# EAGLE design ADC-Board-schematics (EAGLE 6.2)
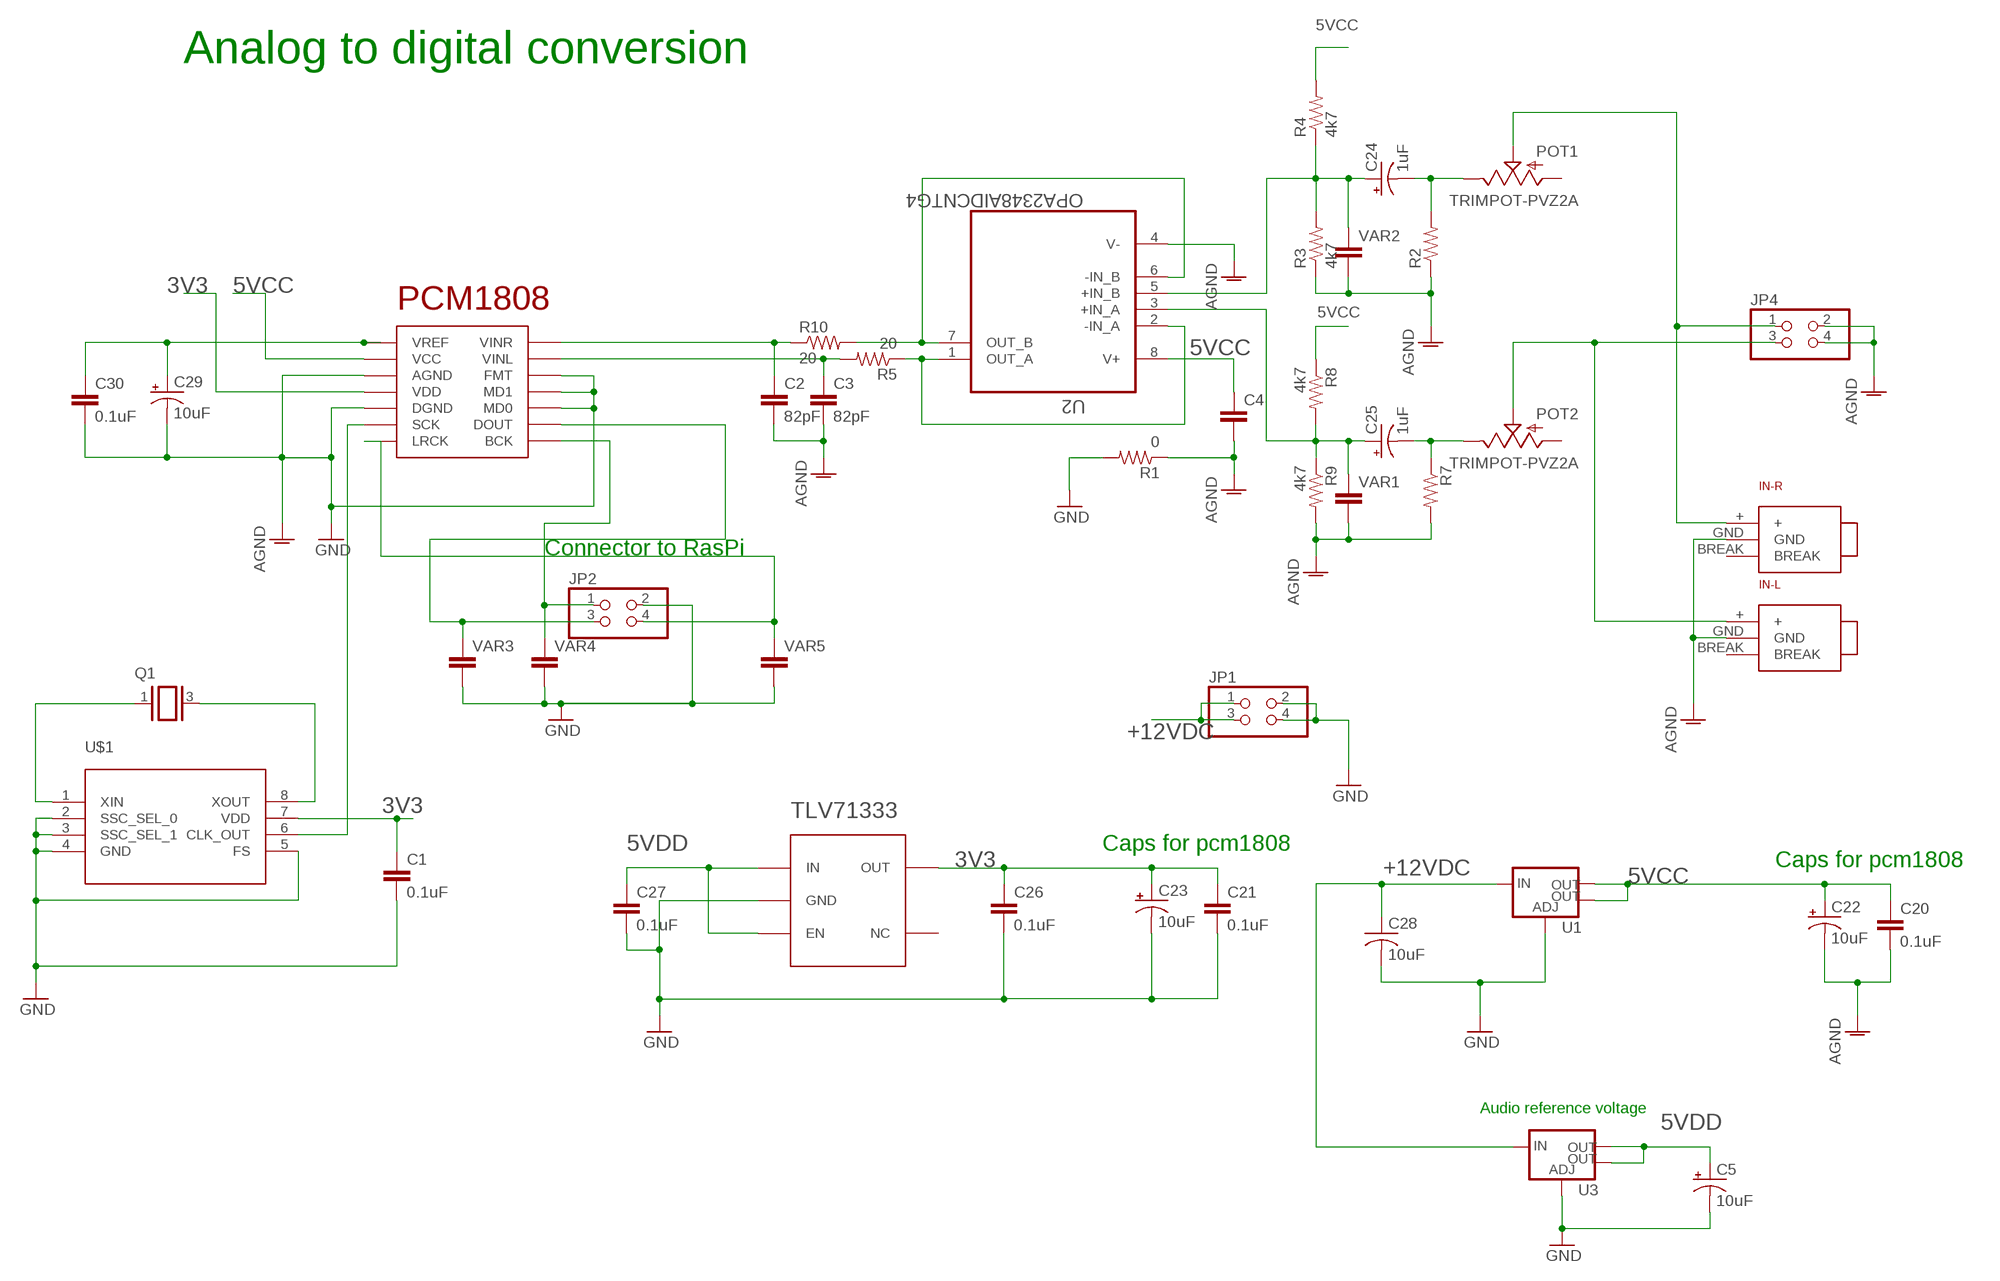
[diagram p0: schematic, sheet 1]

## Parts
C1  0.1uF  C-EUC0603  [C0603]
C2  82pF  CAP0603-CAP  [0603-CAP]
C3  82pF  CAP0603-CAP  [0603-CAP]
C4  CAP0603-CAP  [0603-CAP]
C5  10uF  CPOLRAD  [RADIALCAN4MM]
C20  0.1uF  C-EUC0603  [C0603]
C21  0.1uF  C-EUC0603  [C0603]
C22  10uF  CPOLRAD  [RADIALCAN4MM]
C23  10uF  CPOLRAD  [RADIALCAN4MM]
C24  1uF  CPOLRAD  [RADIALCAN4MM]
C25  1uF  CPOLRAD  [RADIALCAN4MM]
C26  0.1uF  C-EUC0603  [C0603]
C27  0.1uF  C-EUC0603  [C0603]
C28  10uF  C-USC1206  [C1206]
C29  10uF  CPOLRAD  [RADIALCAN4MM]
C30  0.1uF  C-EUC0603  [C0603]
IN-L  3MM5-PLUG  [3MM5-PLUG]
IN-R  3MM5-PLUG  [3MM5-PLUG]
JP1  PINHD-2X2  [2X02]
JP2  PINHD-2X2  [2X02]
JP4  PINHD-2X2  [2X02]
PCM1808  PCM1808PW  [R-PDSO-G14]
POT1  TRIMPOT-PVZ2A  [PVZ2A]
POT2  TRIMPOT-PVZ2A  [PVZ2A]
Q1  XTAL  [5X3CRYSTAL]
R1  0  RESISTOR0603-RES  [0603-RES]
R2  RESISTOR0603-RES  [0603-RES]
R3  4k7  RESISTOR0603-RES  [0603-RES]
R4  4k7  RESISTOR0603-RES  [0603-RES]
R5  20  RESISTOR0603-RES  [0603-RES]
R7  RESISTOR0603-RES  [0603-RES]
R8  4k7  RESISTOR0603-RES  [0603-RES]
R9  4k7  RESISTOR0603-RES  [0603-RES]
R10  20  RESISTOR0603-RES  [0603-RES]
TLV71333  TVL713  [SOT23-5]
U1  V_REG_LM1117SOT223  [SOT223]
U2  OPA2348AIDCNTG4  [SOT65P280X145-8N]
U3  V_REG_LM1117SOT223  [SOT223]
U$1  CDCS502TSSOP-8  [TSSOP-8]
VAR1  CAP0603-CAP  [0603-CAP]
VAR2  CAP0603-CAP  [0603-CAP]
VAR3  CAP0603-CAP  [0603-CAP]
VAR4  CAP0603-CAP  [0603-CAP]
VAR5  CAP0603-CAP  [0603-CAP]

## Nets
3V3: C1.1 C21.1 C23.1(+) C26.1 PCM1808.4(VDD) TLV71333.5(OUT) U$1.7(VDD)
5VCC: C4.1 C20.1 C22.1(+) PCM1808.3(VCC) R4.2 R8.1 U1.2(OUT) U1.4(OUT) U2.8(V+)
5VDD: C5.1(+) C27.1 TLV71333.1(IN) TLV71333.3(EN) U3.2(OUT) U3.4(OUT)
+12VDC: C28.1 JP1.1 JP1.3 U1.3(IN) U3.3(IN)
AGND: C2.2 C3.2 C4.2 IN-L.GND IN-R.GND JP4.2 JP4.4 R1.1 R2.1 R3.1 R7.2 R9.2 U2.4(V-) VAR1.2 VAR2.2
GND: C1.2 C5.2(-) C20.2 C21.2 C22.2(-) C23.2(-) C26.2 C27.2 C28.2 C29.2(-) C30.2 JP1.2 JP1.4 JP2.2 PCM1808.2(AGND) PCM1808.5(DGND) PCM1808.10(MD0) PCM1808.11(MD1) PCM1808.12(FMT) R1.2 TLV71333.2(GND) U1.1(ADJ) U3.1(ADJ) U$1.2(SSC_SEL_0) U$1.3(SSC_SEL_1) U$1.4(GND) U$1.5(FS) VAR3.2 VAR4.2 VAR5.2 ; supply symbol labelled AGND
N$1: JP2.1 PCM1808.8(BCK) VAR4.1
N$3: C24.2(-) POT1.3(E) R2.2
N$4: JP2.3 PCM1808.9(DOUT) VAR3.1
N$5: C24.1(+) R3.2 R4.1 U2.5(+IN_B) VAR2.1
N$6: R5.1 U2.1(OUT_A) U2.2(-IN_A)
N$7: C3.1 PCM1808.13(VINL) R5.2
N$8: C25.2(-) POT2.3(E) R7.1
N$9: C25.1(+) R8.2 R9.1 U2.3(+IN_A) VAR1.1
N$10: R10.2 U2.6(-IN_B) U2.7(OUT_B)
N$11: C2.1 PCM1808.14(VINR) R10.1
N$12: JP2.4 PCM1808.7(LRCK) VAR5.1
N$20: IN-L.+ JP4.3 POT2.2(S)
N$21: IN-R.+ JP4.1 POT1.2(S)
N$29: Q1.1 U$1.1(XIN)
N$30: Q1.3 U$1.8(XOUT)
N$31: C29.1(+) C30.1 PCM1808.1(VREF)
N$32: PCM1808.6(SCK) U$1.6(CLK_OUT)
Unconnected: IN-L.BREAK IN-R.BREAK POT1.1(A) POT2.1(A) TLV71333.4(NC)

## Notes on the sheet
- Analog to digital conversion
- Connector to RasPi
- Caps for pcm1808
- Caps for pcm1808
- Audio reference voltage

## Library data of the parts
C1 C20 C21 C26 C27 C30 = rcl:C-EU: CAPACITOR, European symbol
C2-C4 VAR1-VAR5 = SparkFun-Passives:CAP: Capacitor Standard 0603 ceramic capacitor, and 0.1" leaded capacitor.
C5 C22-C25 C29 = rcl:CPOLRAD
C28 = rcl:C-US: CAPACITOR, American symbol
IN-L IN-R = Pekkas_libraries:3MM5-PLUG
JP1 JP2 JP4 = pinhead:PINHD-2X2: PIN HEADER
PCM1808 = Pekkas_libraries:PCM1808PW: TEXAS INSTRUMENTS PCM1808PW. Analogue to Digital Converter, 24 bit, 96 kSPS, Single, 4.5 V, 5.5 V, TSSOP
POT1 POT2 = SparkFun-Resistors:TRIMPOT-PVZ2A
Q1 = Pekkas_libraries:XTAL: TXC 7B-12.288MEEQ-T XTAL, 12.288MHZ, 10PF, SMD, 5.0X3.2
R1-R5 R7-R10 = SparkFun-Passives:RESISTOR: Resistor Basic schematic elements and footprints for 0603, 1206, and PTH resistors.
TLV71333 = Pekkas_libraries:TVL713: TEXAS INSTRUMENTS TLV71333PDBVR Fixed LDO Voltage Regulator, 1.4V to 5.5V, 230mV Dropout, 3.3Vout, 150mAout, SOT-23-5
U1 U3 = SparkFun-PowerIC:V_REG_LM1117: Voltage Regulator LM1117 Standard adjustable voltage regulator but in SMD form. Spark Fun Electronics SKU : COM-00595; PROD_ID: VREG-08170
U2 = Pekkas_libraries:OPA2348AIDCNTG4: OPERATIONAL AMPLIFIERS; MPN: OPA2348AIDCNTG4; OC_FARNELL: 1207098; OC_NEWARK: 97K6805; PACKAGE: SOT23-8; SUPPLIER: Texas Instruments
U$1 = components:CDCS502

## Board
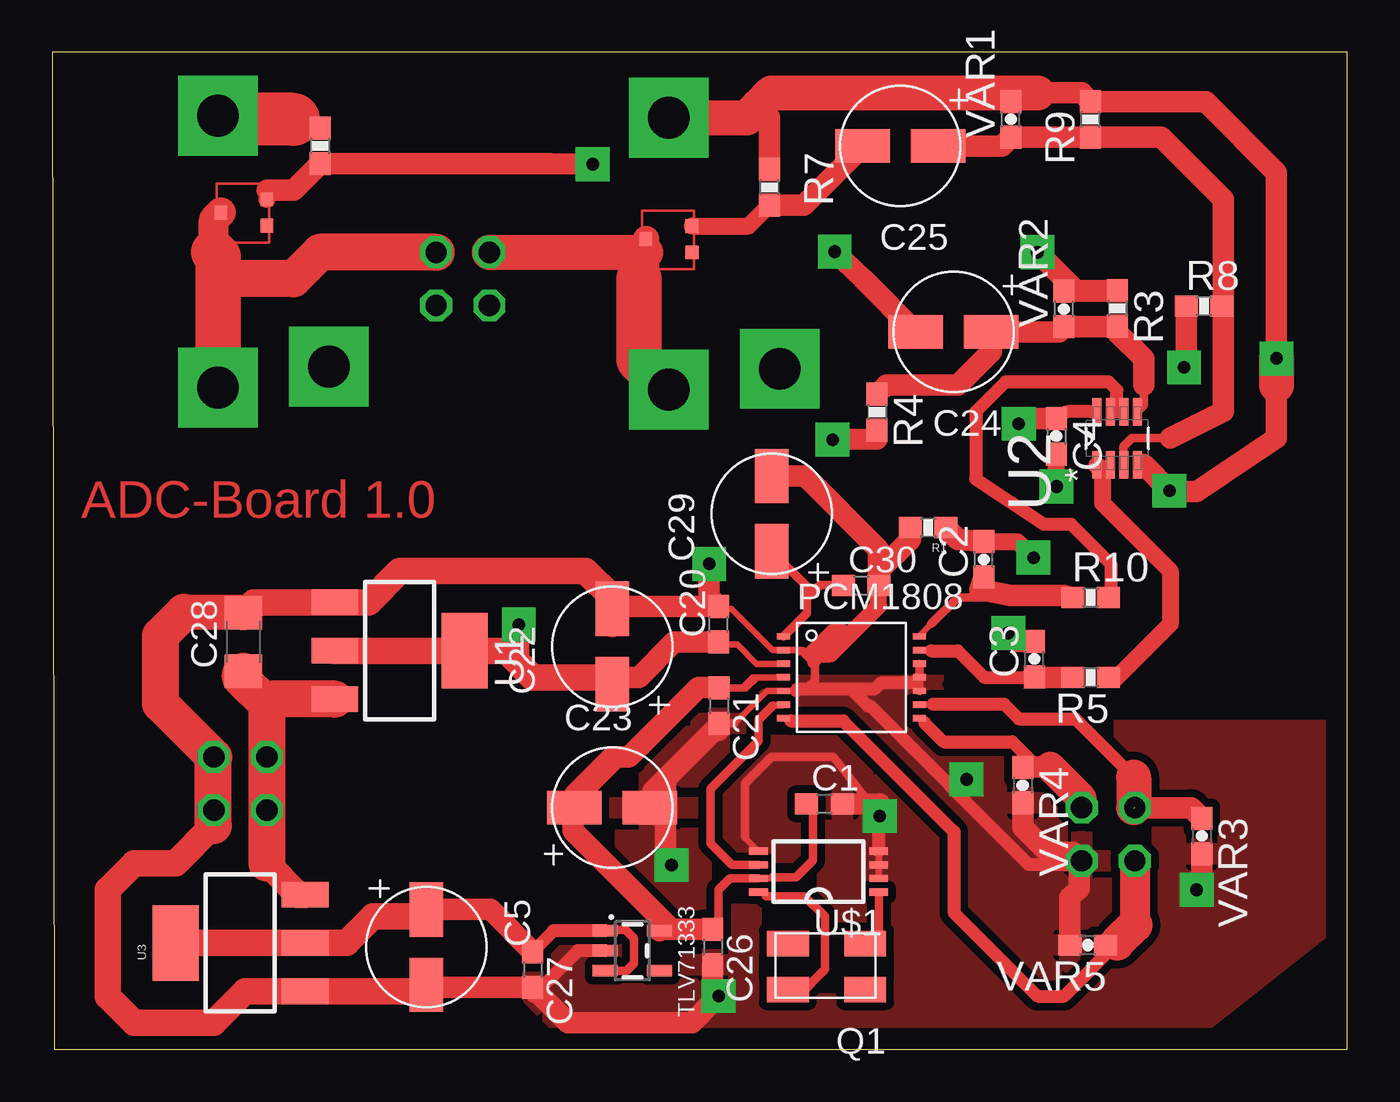
[diagram p1: board, top side]
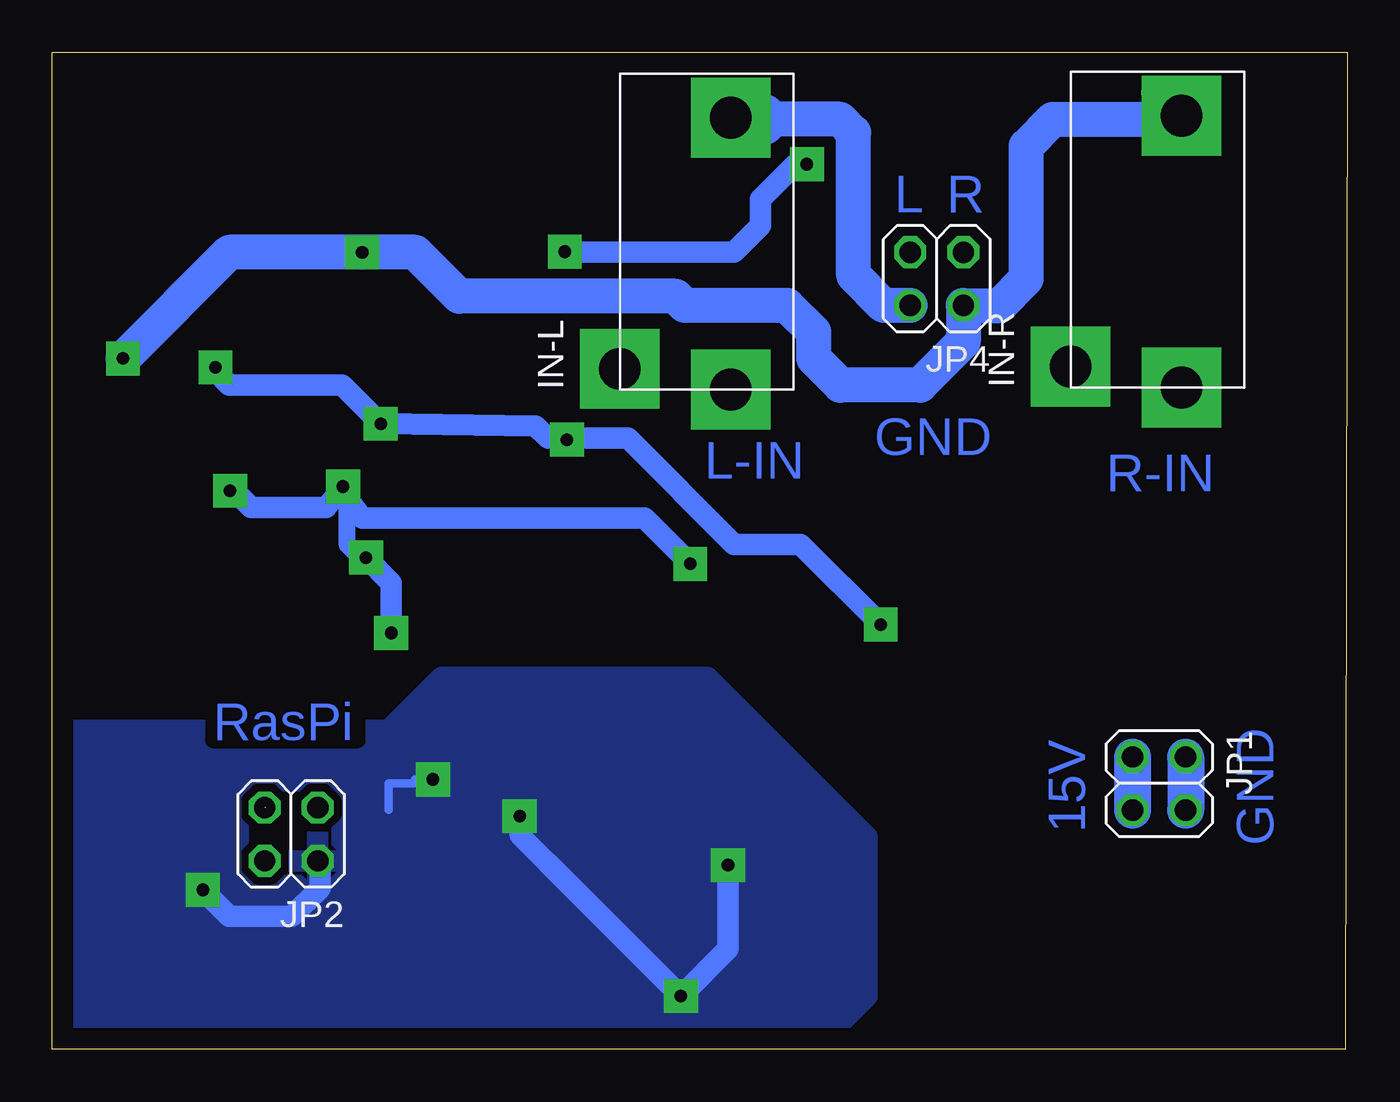
[diagram p2: board, bottom side, seen from below]

Size 61.9 x 47.66 mm. Coordinates in mm from the lower left corner, seen from the top.
Outline: 0.1,0 61.9,0 61.9,47.66 0,47.66 0.1,0
Copper layers (1*16): Top 0.035mm / dielectric 1.5mm / Bottom 0.035mm
Design rules: minimum track width 10mil, minimum drill 24mil, track to track 15mil, track to pad 15mil, pad to pad 15mil, via to via 15mil, smd to smd 8mil, copper to edge 40mil, drill to drill 8mil, minimum pad ring 10mil, minimum via ring 20mil, stop-mask expansion 4mil, vias tented up to drill 0mil, thermal gap 10mil

### Footprints (pad centres in the part's own frame; a part is rotated, then mirrored left to right if it is on the bottom)
C0603 = smd 1.1 x 1: 1 -0.85,0; 2 0.85,0
0603-CAP = smd 1.1 x 1: 1 -0.85,0; 2 0.85,0
RADIALCAN4MM = smd 2.6 x 1.6: 1 -1.6,0; 2 2,0
C1206 = smd 1.6 x 1.8: 1 -1.4,0; 2 1.4,0
3MM5-PLUG = drill 2 pad 3.81 square: + -13,0; BREAK -12,5.3; GND 0,0
2X02 = drill 1.016 octagon: 1 -1.27,-1.27; 2 -1.27,1.27; 3 1.27,-1.27; 4 1.27,1.27
R-PDSO-G14 = smd 0.61 x 0.305: 1 -3.25,1.95; 2 -3.25,1.3; 3 -3.25,0.65; 4 -3.25,0; 5 -3.25,-0.65; 6 -3.25,-1.3; 7 -3.25,-1.95; 8 3.25,-1.95; 9 3.25,-1.3; 10 3.25,-0.65; 11 3.25,0; 12 3.25,0.65; 13 3.25,1.3; 14 3.25,1.95
PVZ2A = smd 0.65 x 0.6: 1 0,0; 2 0.625,2.2; 3 1.25,0
5X3CRYSTAL = smd 2 x 1.2: 1 0,0; 2 3.7,0; 3 3.7,2.2; 4 0,2.2
0603-RES = smd 1.1 x 1: 1 -0.85,0; 2 0.85,0
SOT23-5 = smd 0.55 x 1.2: 1 -0.95,-1.3; 2 0,-1.3; 3 0.95,-1.3; 4 0.95,1.3; 5 -0.95,1.3
SOT223 = smd 1.219 x 2.235: 1 -2.311,-3.099; 2 0,-3.099; 3 2.311,-3.099 | smd 3.6 x 2.2: 4 0,3.099
SOT65P280X145-8N = smd 1.321 x 0.432: 1 -1.27,0.965; 2 -1.27,0.33; 3 -1.27,-0.33; 4 -1.27,-0.965; 5 1.27,-0.965; 6 1.27,-0.33; 7 1.27,0.33; 8 1.27,0.965
TSSOP-8 = smd 0.9 x 0.35: 1 -2.875,0.975; 2 -2.875,0.325; 3 -2.875,-0.325; 4 -2.875,-0.975; 5 2.875,-0.975; 6 2.875,-0.325; 7 2.875,0.325; 8 2.875,0.975

### Placement (x,y rotation side)
C1  36.91,11.73 0 top
C2  44.53,23.42 90 top
C3  46.95,18.65 90 top
C4  47.99,29.31 270 top
C5  17.88,5.08 270 top
C20  31.85,20.32 90 top
C21  31.86,16.43 270 top
C22  26.77,19.05 90 top
C23  26.56,11.54 0 top
C24  43.28,34.29 180 top
C25  40.74,43.18 180 top
C26  31.57,4.89 270 top
C27  22.96,3.81 270 top
C28  9.14,19.47 90 top
C29  34.39,25.4 90 top
C30  38.67,22.16 0 top
IN-L  29.47,44.53 90 bottom
IN-R  7.92,44.63 90 bottom
JP1  8.99,12.7 270 bottom
JP2  50.48,10.28 180 bottom
JP4  19.62,36.83 180 bottom
PCM1808  38.2,17.78 0 top
POT1  10.26,39.37 90 top
POT2  30.58,38.1 90 top
Q1  38.86,5.05 180 top
R1  41.86,24.94 180 top
R2  12.8,43.18 270 top
R3  50.92,35.42 270 top
R4  39.43,30.46 270 top
R5  49.63,17.78 180 top
R7  34.29,41.21 90 top
R8  55.06,35.53 0 top
R9  49.63,44.45 90 top
R10  49.63,21.59 0 top
TLV71333  27.73,4.71 270 top
U1  16.61,19.05 270 top
U2  50.9,29.21 90 top
U3  8.99,5.08 90 top
U$1  36.63,8.49 180 top
VAR1  45.82,44.45 90 top
VAR2  48.36,35.39 90 top
VAR3  54.95,10.19 270 top
VAR4  46.39,12.62 270 top
VAR5  49.5,4.98 180 top

### Tracks (layer width: path | path; a pad name or v marks a point on that pad's centre or on a via)
3V3
  Top 0.305: C21.1 31.9,17.24 33.16,17.24 33.7,17.78 PCM1808.4 33.48,17.78 33,17.3 31.1,17.3 30.8,17 30.5,17 24.9,11.4 | U$1.7 34.36,8.16 34.41,8.22
  Top 0.406: C1.1 36.36,11.43 36.36,9.04 35.54,8.22 34.41,8.22 | U$1.7 32.4,8.16 31.85,7.62 31.85,6.02 C26.1
  Top 1.016: C23.1 24.96,12.16 26.77,13.97 27.57,13.97 30.9,17.3 31.84,17.3 C21.1 | C26.1 29.6,5.74 | 29.6,5.74 29.11,5.74 TLV71333.5 | 24.9,11.4 24.9,10.44 29.6,5.74
5VCC  (via drill 0.6)
  Top 0.305: PCM1808.3 33.67,18.43 32.76,19.34 31.98,19.34 C20.1
  Top 0.406: U2.8 49.63,30.48
  Top 0.61: 49.63,30.48 48.51,30.48 C4.1
  Top 1.016: C20.1 29.73,19.47 28.04,17.78 27.1,17.78 C22.1 | C4.1 46.26,30.16 v46.2,29.9 | v22.3,20.3 22.3,18.9 22.07,18.67 | R4.2 39.43,29.17 v37.3,29.14 | R8.1 54.21,32.71 v54.1,32.6
  Top 1.27: U1.2 U1.4 21.69,19.05 22.07,18.67 22.96,17.78 26.44,17.78 C22.1
  Bottom 1.016: 36.93,29.21 38.2,29.21 38.79,29.8 v46.2,29.9 48.05,31.75 53.44,31.75 54.1,32.41 v54.1,32.6 | 36.93,29.21 34.39,29.21 29.31,24.13 26.13,24.13 v22.3,20.3 | v37.3,29.14 36.93,29.21
5VDD
  Top 0.406: TLV71333.3 27.46,3.76 27.8,4.1 27.8,5.3 27.4,5.7 26.47,5.7 TLV71333.1
  Top 0.61: TLV71333.1 23.96,5.66 C27.1
  Top 1.016: C5.1 20.94,6.68 C27.1
  Top 1.27: U3.4 U3.2 14.07,5.08 15.34,6.35 17.55,6.35 C5.1
+12VDC
  Top 1.27: U3.3 11.76,7.39 10.26,8.89
  Top 1.778: 10.26,16.51 JP1.1 10.26,8.89 | 10.26,16.51 8.99,17.78 8.99,17.92 C28.1 | U1.3 10.49,16.74 10.26,16.51
  Bottom 1.778: JP1.1 JP1.3
AGND  (via drill 0.6)
  Top 0.406: 52.17,27.94 U2.4 52.16,27.94 v53.4,26.7
  Top 0.813: C2.2 46.13,24.27 v46.9,23.5 | v48,26.9 C4.2
  Top 1.016: R2.1 11.95,44.03 11.53,44.45 | R7.2 34.29,44.55 33.76,45.09 | VAR1.2 46.24,45.72 47.09,45.72 49.21,45.72 R9.2 55.13,45.3 58.52,41.91 v58.52,33.02 | 58.52,31.75 58.52,29.21 54.71,26.67 53.44,26.67 52.17,27.94 | VAR2.2 50.89,36.24 R3.1 48.92,36.27 v47.09,38.1 | C2.2 43.28,24.37 R1.1 | C3.2 46.1,19.5 v45.7,19.9
  Top 1.676: IN-L.GND 33.2,44.53 33.76,45.09 34.39,45.72 47.09,45.72 | v58.52,33.02 58.52,31.75
  Top 2.54: 11.53,44.45 8.1,44.45 IN-R.GND
  Bottom 0.813: v46.9,23.5 47.3,23.6 47.8,24.1 47.8,26.5 v48,26.9
  Bottom 1.016: v53.4,26.7 53.2,26.7 52.4,25.9 48.8,25.9 v48,26.9 | v45.7,19.9 45.7,22.3 v46.9,23.5
  Bottom 1.676: 9.01,45.72 IN-R.GND 8.1,44.45 14.07,44.45 15.34,43.18 15.34,36.83 16.61,35.56 JP4.2 18.35,33.82 20.42,31.75 24.23,31.75 25.5,33.02 25.5,34.29 26.77,35.56 31.66,35.56 32.1,36 42.45,36 44.55,38.1 v47.09,38.1 53.44,38.1 v58.52,33.02 | JP4.4 22.16,35.56 23.6,37 23.6,43.82 24.23,44.45 28.04,44.45
  Bottom 2.54: 28.04,44.45 29.39,44.45 IN-L.GND
GND  (via drill 0.6)
  Top 0.305: 35.66,19.05 35.63,19.08 PCM1808.2 34.42,19.08 32.46,21.04 31.98,21.04 C20.2 | 35.56,17.14 PCM1808.5 34.16,17.14 32.6,15.58 C21.2 | 33.12,10.16 33.12,10.1 U$1.5 | U$1.2 U$1.3 U$1.4
  Top 0.406: 35.66,19.05 35.85,19.05 36.39,18.51 36.46,18.44 36.46,17.64 36.13,17.31 | 36.13,17.31 35.96,17.14 35.56,17.14 | 33.12,10.16 33.12,12.7 34.39,13.97 37.33,13.97 v39.56,11.14 | 38.36,17.24 36.2,17.24 36.13,17.31 | PCM1808.12 PCM1808.11 PCM1808.10 41.45,17.25 41.2,17.5 | C26.2 31.57,2.82 v31.85,2.54 | 32.6,15.58 32.19,15.58 31.85,15.24 29.31,12.7
  Top 0.61: 37.78,19.9 36.39,18.51 | U$1.4 39.51,11.69 v39.56,11.14 | TLV71333.2 25.13,4.71 22.96,2.54 C27.2 | 41.2,17.5 39.6,17.5 39.3,17.2 38.2,17.2 | 38.2,17.2 35.62,17.2 35.56,17.14 | 38.2,17.2 39,16.4 39.1,16.4 46.67,8.83 49.03,8.83 JP2.2
  Top 0.813: 37.78,19.9 37.3,19.9 36.3,18.9 37.2,18.9 39.5,21.2 39.5,22.14 C30.2
  Top 1: C1.2 39.55,11.73 v39.56,11.14
  Top 1.016: C5.2 18,2.96 C27.2 24.65,1.27 30.58,1.27 31.57,2.26 C26.2 | 31.85,15.24 31.64,15.24 28.7,12.3 28.7,11.68 C23.2 | 29.31,12.7 29.31,8.59 v29.6,8.8 | C22.2 26.89,21.17 C20.2 31.4,21.62 v31.4,23.2 | C29.2 36,27.4 39.5,23.9 39.5,22.86 | 39.5,22.86 39.5,22.18 C30.2 | R1.2 41.01,24.37 39.5,22.86 | VAR5.2 48.65,7.25 49.1,7.7 49.1,8.9 JP2.2 48.82,9.4 47.6,9.4 46.39,10.61 VAR4.2 | VAR3.2 54.95,7.86 v54.71,7.62
  Top 1.27: 7.7,10.7 5.89,8.89 3.91,8.89 2.64,7.62 2.64,2.54 3.91,1.27 7.72,1.27 9.22,2.77 U3.1 17.57,2.77 C5.2 | C28.2 9.63,21.36 U1.1 15.11,21.36 16.61,22.86 25.5,22.86 26.77,21.59 26.77,20.32
  Top 1.676: 6.3,20.9 9.11,20.9 C28.2
  Top 1.778: 6.3,20.9 5.18,19.78 5.18,16.51 JP1.2 7.7,13.95 7.7,10.7
  Bottom 0.406: v43.7,12.9 44.55,12.9 44.55,12.7 45.82,12.7 45.82,11.43
  Bottom 1: v39.56,11.14 39.56,10.25 38.2,8.89
  Bottom 1.016: 38.2,8.89 v31.85,2.54 29.6,4.79 v29.6,8.8 | 48.1,26.7 47.09,25.4 33.6,25.4 v31.4,23.2 | v54.71,7.62 53.44,6.35 50.45,6.35 49.1,7.7 49.1,8.9 JP2.2
  Bottom 1.778: JP1.2 JP1.4
  pour Top: 62.33,15.24 45.06,15.24 42.9,17.4 30.2,17.4 22.96,10.16 22.96,2.54 25,0.5 53.98,0.5 61.9,6.77 61.8,15.2 62.29,15.2
  pour Bottom: 62.33,15.24 45.82,15.24 43.28,17.78 30.58,17.78 22.96,10.16 22.96,2.54 25.5,0 62.33,0
N$1
  Top 0.305: PCM1808.8 41.47,15.83 41.7,15.6
  Top 0.61: 41.7,15.6 42.6,14.7 45.89,14.7 47.09,13.5
  Top 1.016: 47.7,13.5 47.09,13.5 46.42,13.5 VAR4.1
  Top 1.422: JP2.1 49.21,11.99 47.7,13.5
N$3  (via drill 0.6)
  Top 0.813: POT1.3 10.26,41.06
  Top 1.016: 10.26,41.06 11.53,41.06 R2.2 23.81,42.33 v25.83,42.31 | v37.4,38.13 38.74,36.83 C24.2
  Bottom 1.016: v37.4,38.13 36.93,38.1 29.31,38.1 28.04,39.37 28.04,40.64 26.37,42.31 v25.83,42.31
N$4  (1 unrouted)
  Top 0.305: PCM1808.9 42.08,16.48 42.1,16.5
  Top 0.61: 42.1,16.5 45.5,16.5 46.2,15.8 48.9,15.8 51.7,13
  Top 1.016: 51.7,11.54 54.45,11.54 VAR3.1
  Top 1.676: 51.7,13 51.7,11.54
N$5
  Top 0.406: 52.17,31.75 52.17,30.79 U2.5
  Top 1.016: 52.17,31.75 52.17,33.02 50.92,34.27 R3.2 50.89,34.54 VAR2.1 48.11,34.29 C24.1 44.88,33.35 43.28,31.75 39.87,31.75 R4.1
N$6
  Top 0.406: U2.1 U2.2
  Top 0.813: U2.1 49.94,27.86 50.2,27.6 50.2,26.1 53.44,22.86 53.44,20.32 50.87,17.75 R5.1
N$7
  Top 0.305: PCM1808.13 41.98,19.08 42.01,19.05
  Top 0.61: 42.01,19.05 43.28,19.05 44.55,17.78 47.09,17.78
  Top 1.016: R5.2 47.09,17.78 46.97,17.78 C3.1
N$8
  Top 0.813: POT2.3 33.28,39.35 R7.1
  Top 1.016: 38.46,42.9 C25.2 35.92,40.36 R7.1
N$9
  Top 0.406: 53.44,29.21 51.61,29.21 51.2,28.8 51.2,27.97 U2.3
  Top 1.016: C25.1 45.4,43.18 VAR1.1 R9.1 53.02,43.6 55.98,40.64 55.98,35.56 | 55.98,35.56 55.98,30.48 53.44,29.21 | R8.2 55.95,35.53 55.98,35.56
N$10
  Top 0.305: U2.6 50.9,30.48 U2.7
  Top 0.61: 50.9,30.48 50.9,31.5 50.5,31.9 45.57,31.9 44.15,30.48 44.15,27.27 47.39,25.1 48.7,25.1 50.6,23.2 50.6,21.71 R10.2 50.4,21.61
N$11
  Top 0.305: PCM1808.14 41.45,19.76 42.01,20.32
  Top 0.406: 42.01,20.32 43.28,21.59 R10.1
  Top 1.016: C2.1 44.33,21.97 45.8,21.7 48.37,21.7 R10.1
N$12
  Top 0.305: PCM1808.7 35.17,15.83 35.3,15.7
  Top 0.61: 35.3,15.7 37.8,15.7 43.1,10.4 43.1,6.53 47.09,2.54 48.36,2.54 50.9,5.08
  Top 1.016: 50.9,5.08 50.45,5.08 VAR5.1
  Top 1.422: JP2.4 51.75,5.93
  Top 1.676: 51.75,5.93 50.9,5.08
N$20
  Top 1.27: POT2.2 28.38,38.1 28.38,37.17 28.04,36.83
  Top 1.676: JP4.3 28.38,38.1
  Top 2.184: 28.04,36.83 28.04,32.96 IN-L.+
N$21
  Top 1.422: 7.72,38.1 7.72,39.66 POT1.2
  Top 1.778: JP4.1 12.8,38.1 11.53,36.83 7.92,36.83
  Top 2.184: IN-R.+ 7.92,36.83 7.92,37.9 7.72,38.1
N$29
  Top 0.305: 38.73,5.18 Q1.1 | U$1.1 39.51,7.33 39.51,7.32
  Top 0.406: 39.51,7.32 39.51,5.7 Q1.1
N$30
  Top 0.305: U$1.8 33.91,7.51 34.11,7.32
  Top 0.406: 34.11,7.32 35.96,7.32 36.93,6.35 36.93,3.81 35.66,2.54 35.47,2.54 Q1.3
N$31
  Top 0.406: PCM1808.1 36.08,20.86 36.08,21.58 | 36.08,21.58 36.7,22.2 37.78,22.2 C30.1 | 36.08,21.58 36.08,22.11 C29.1
N$32
  Top 0.305: 34.46,16.44 34.91,16.44 PCM1808.6
  Top 0.406: 34.46,16.44 33.76,15.74 33.76,14.74 31.46,12.44 31.46,9.84 32.48,8.81 U$1.6

### Text on the board
Top: ADC-Board 1.0
Bottom: R | L | GND | R-IN | L-IN | 15V | RasPi | GND